# EAGLE schematic lab4 (EAGLE 9.3.0)
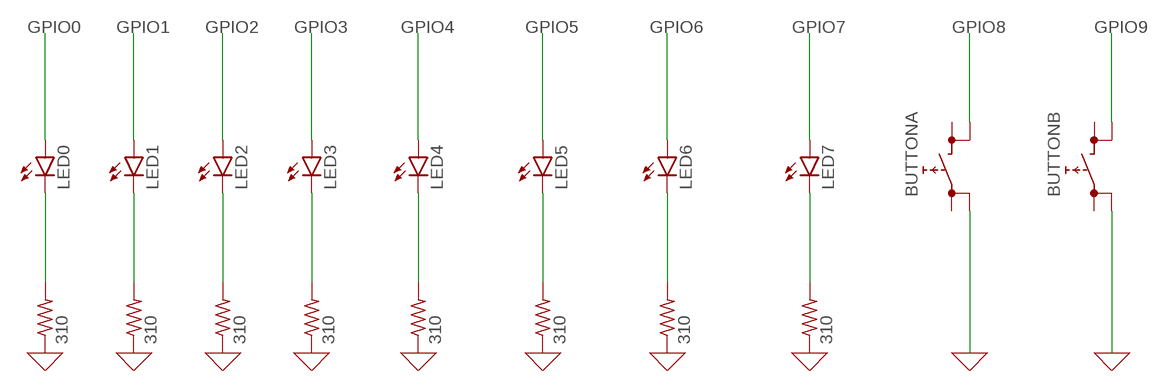
[diagram p0: schematic, sheet 1]

## Parts
BUTTONA  REKN  [REKN]
BUTTONB  REKN  [REKN]
LED0  LAP4-BOTTOM  [P47F-BOTTOM]
LED1  LAP4-BOTTOM  [P47F-BOTTOM]
LED2  LAP4-BOTTOM  [P47F-BOTTOM]
LED3  LAP4-BOTTOM  [P47F-BOTTOM]
LED4  LAP4-BOTTOM  [P47F-BOTTOM]
LED5  LAP4-BOTTOM  [P47F-BOTTOM]
LED6  LAP4-BOTTOM  [P47F-BOTTOM]
LED7  LAP4-BOTTOM  [P47F-BOTTOM]
R1  310  R-US_0204/2V  [0204V]
R2  310  R-US_0204/2V  [0204V]
R3  310  R-US_0204/2V  [0204V]
R4  310  R-US_0204/2V  [0204V]
R5  310  R-US_0204/2V  [0204V]
R6  310  R-US_0204/2V  [0204V]
R7  310  R-US_0204/2V  [0204V]
R8  310  R-US_0204/2V  [0204V]

## Nets
0: BUTTONA.0B BUTTONB.0B R1.1 R2.1 R3.1 R4.1 R5.1 R6.1 R7.1 R8.1 ; supply symbol labelled GND
GPIO0: LED0.A
GPIO1: LED1.A
GPIO2: LED2.A
GPIO3: LED3.A
GPIO4: LED4.A
GPIO5: LED5.A
GPIO6: LED6.A
GPIO7: LED7.A
GPIO8: BUTTONA.1B
GPIO9: BUTTONB.1B
N$1: LED5.C R2.2
N$2: LED4.C R1.2
N$3: LED6.C R3.2
N$4: LED3.C R4.2
N$5: LED2.C R5.2
N$6: LED1.C R6.2
N$7: LED0.C R7.2
N$8: LED7.C R8.2
Unconnected: BUTTONA.0A BUTTONA.1A BUTTONB.0A BUTTONB.1A

## Library data of the parts
BUTTONA BUTTONB = switch:REKN: PUSH SWITCH ITT-Cannon-Cannon
LED0 LED1-LED7 = led:*P4: PointLED® Enhanced Thinfilm LED TOP & BOTTOM mount LS P47F, LR P47F, LA P47F, LY P47F, LT P4SG, LB P4SG, LW P4SG Source: http://catalog.osram-os.com .. LA_LR_LS_LY_P47F_Pb_free.pdf
R1-R8 = rcl:R-US_: RESISTOR, American symbol; SPICEPREFIX: R